# Altium schematic sheet main.SchDoc
size A4; DocumentNumber: 1; SheetNumber: 1; SheetTotal: 21; SheetName: Top level
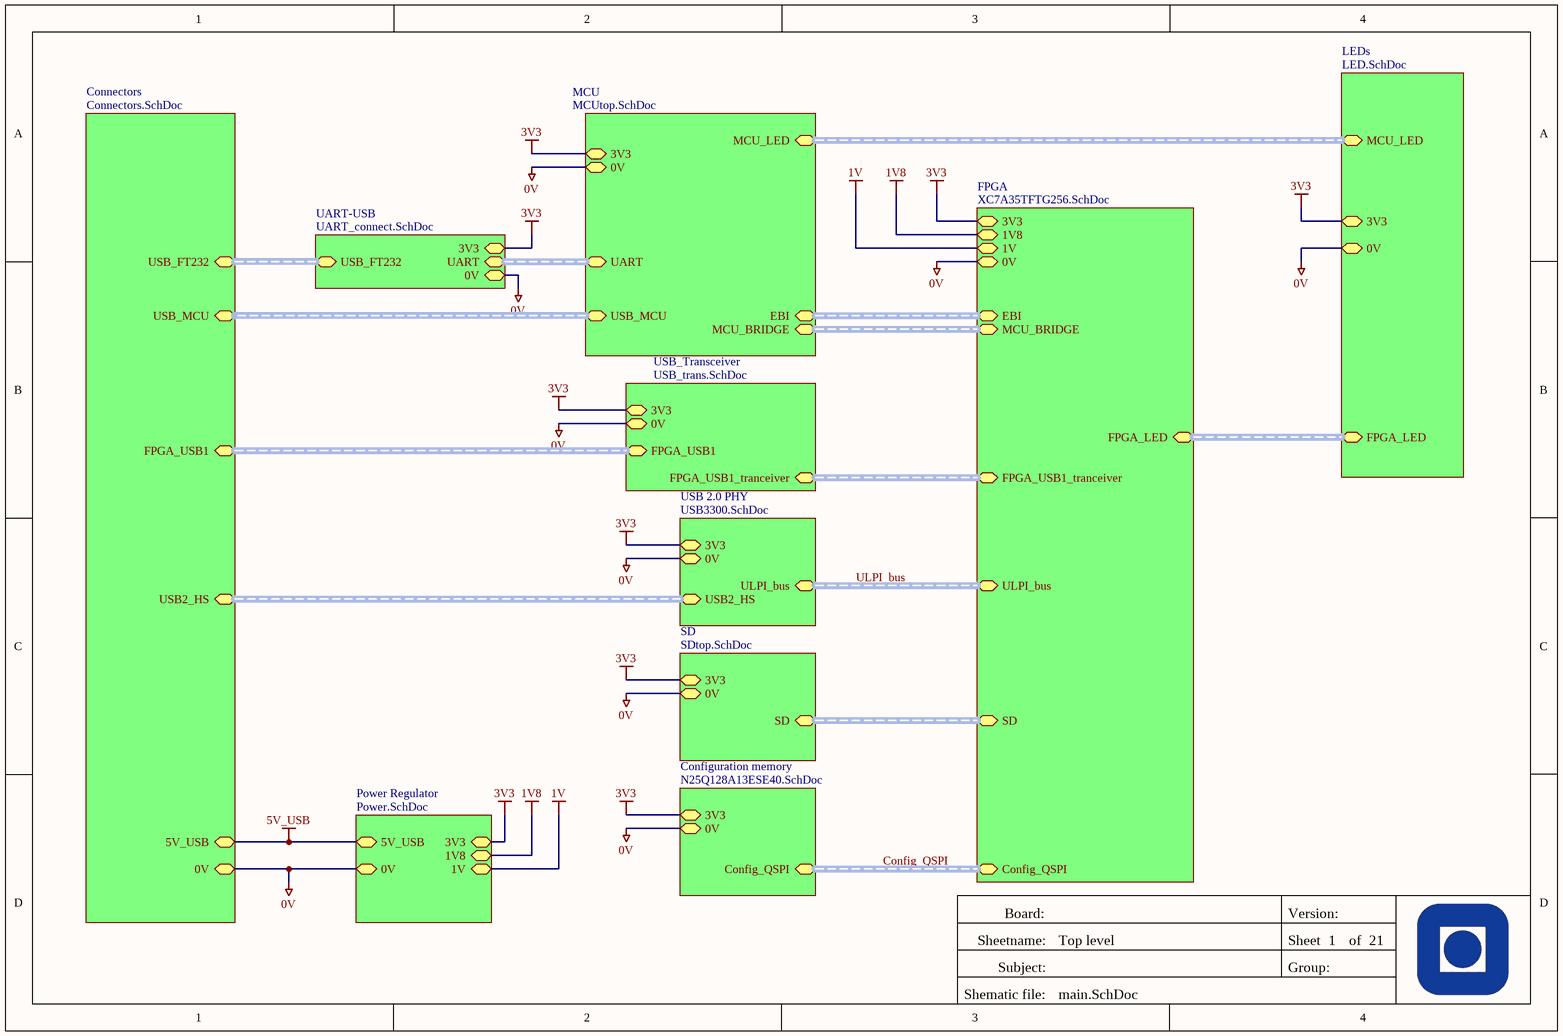
[diagram p0: main.SchDoc]

## Sub-sheets
Configuration memory = N25Q128A13ESE40.SchDoc: Config_QSPI (harness QSPI), 3V3, 0V
Connectors = Connectors.SchDoc: USB_MCU (harness USB), USB2_HS (harness USB), FPGA_USB1 (harness USB), 5V_USB, 0V, USB_FT232 (harness USB)
FPGA = XC7A35TFTG256.SchDoc: EBI (harness EBI), MCU_BRIDGE (harness MCU_CTRL_LOGIC), SD (harness SD_card), 3V3, 1V8, 1V, Config_QSPI (harness QSPI), FPGA_LED (harness LED_Harness), ULPI_bus (harness ULPI), 0V, FPGA_USB1_tranceiver (harness USB1_FS_harness)
LEDs = LED.SchDoc: FPGA_LED (harness LED_Harness), MCU_LED, 0V, 3V3
MCU = MCUtop.SchDoc: 3V3, 0V, EBI (harness EBI), MCU_BRIDGE (harness MCU_CTRL_LOGIC), USB_MCU (harness USB), MCU_LED (harness LED_Harness), UART (harness UART)
Power Regulator = Power.SchDoc: 5V_USB, 0V, 3V3, 1V8, 1V
SD = SDtop.SchDoc: SD (harness SD_card), 3V3, 0V
UART-USB = UART_connect.SchDoc: USB_FT232 (harness USB), UART (harness UART), 0V, 3V3
USB 2.0 PHY = USB3300.SchDoc: 3V3, 0V, USB2_HS (harness USB), ULPI_bus (harness ULPI)
USB_Transceiver = USB_trans.SchDoc: 3V3, 0V, FPGA_USB1 (harness USB), FPGA_USB1_tranceiver (harness USB1_FS_harness)

## Nets
0V: sheet MCU/0V, sheet FPGA/0V, sheet SD/0V, sheet Power Regulator/0V, sheet Configuration memory/0V, sheet USB 2.0 PHY/0V, sheet LEDs/0V, sheet Connectors/0V, sheet USB_Transceiver/0V, sheet UART-USB/0V
1V: sheet FPGA/1V, sheet Power Regulator/1V
1V8: sheet FPGA/1V8, sheet Power Regulator/1V8
3V3: sheet MCU/3V3, sheet FPGA/3V3, sheet SD/3V3, sheet Power Regulator/3V3, sheet Configuration memory/3V3, sheet USB 2.0 PHY/3V3, sheet LEDs/3V3, sheet USB_Transceiver/3V3, sheet UART-USB/3V3
5V_USB: sheet Power Regulator/5V_USB, sheet Connectors/5V_USB

## Buses and harness runs
harness Config_QSPI = sheet Configuration memory/Config_QSPI = sheet FPGA/Config_QSPI
harness sheet Connectors/FPGA_USB1 = sheet USB_Transceiver/FPGA_USB1
harness sheet Connectors/USB2_HS = sheet USB 2.0 PHY/USB2_HS
harness sheet Connectors/USB_FT232 = sheet UART-USB/USB_FT232
harness sheet Connectors/USB_MCU = sheet MCU/USB_MCU
harness sheet FPGA/EBI = sheet MCU/EBI
harness sheet FPGA/FPGA_LED = sheet LEDs/FPGA_LED
harness sheet FPGA/FPGA_USB1_tranceiver = sheet USB_Transceiver/FPGA_USB1_tranceiver
harness sheet FPGA/MCU_BRIDGE = sheet MCU/MCU_BRIDGE
harness sheet FPGA/SD = sheet SD/SD
harness sheet LEDs/MCU_LED = sheet MCU/MCU_LED
harness sheet MCU/UART = sheet UART-USB/UART
harness ULPI_bus = sheet FPGA/ULPI_bus = sheet USB 2.0 PHY/ULPI_bus

## Notes on the sheet
- Board:
- Version:
- Sheetname:
- Subject:
- Group:
- Sheet
- of
- Shematic file: